# EasyEDA schematic G1000_Cessna_Main.json
TITLE: G1000_Cessna_Main; REV: 1.0; Date: 2024-05-07; Sheet: 1/1; Drawn By: gagagu1; Company: Gagagu
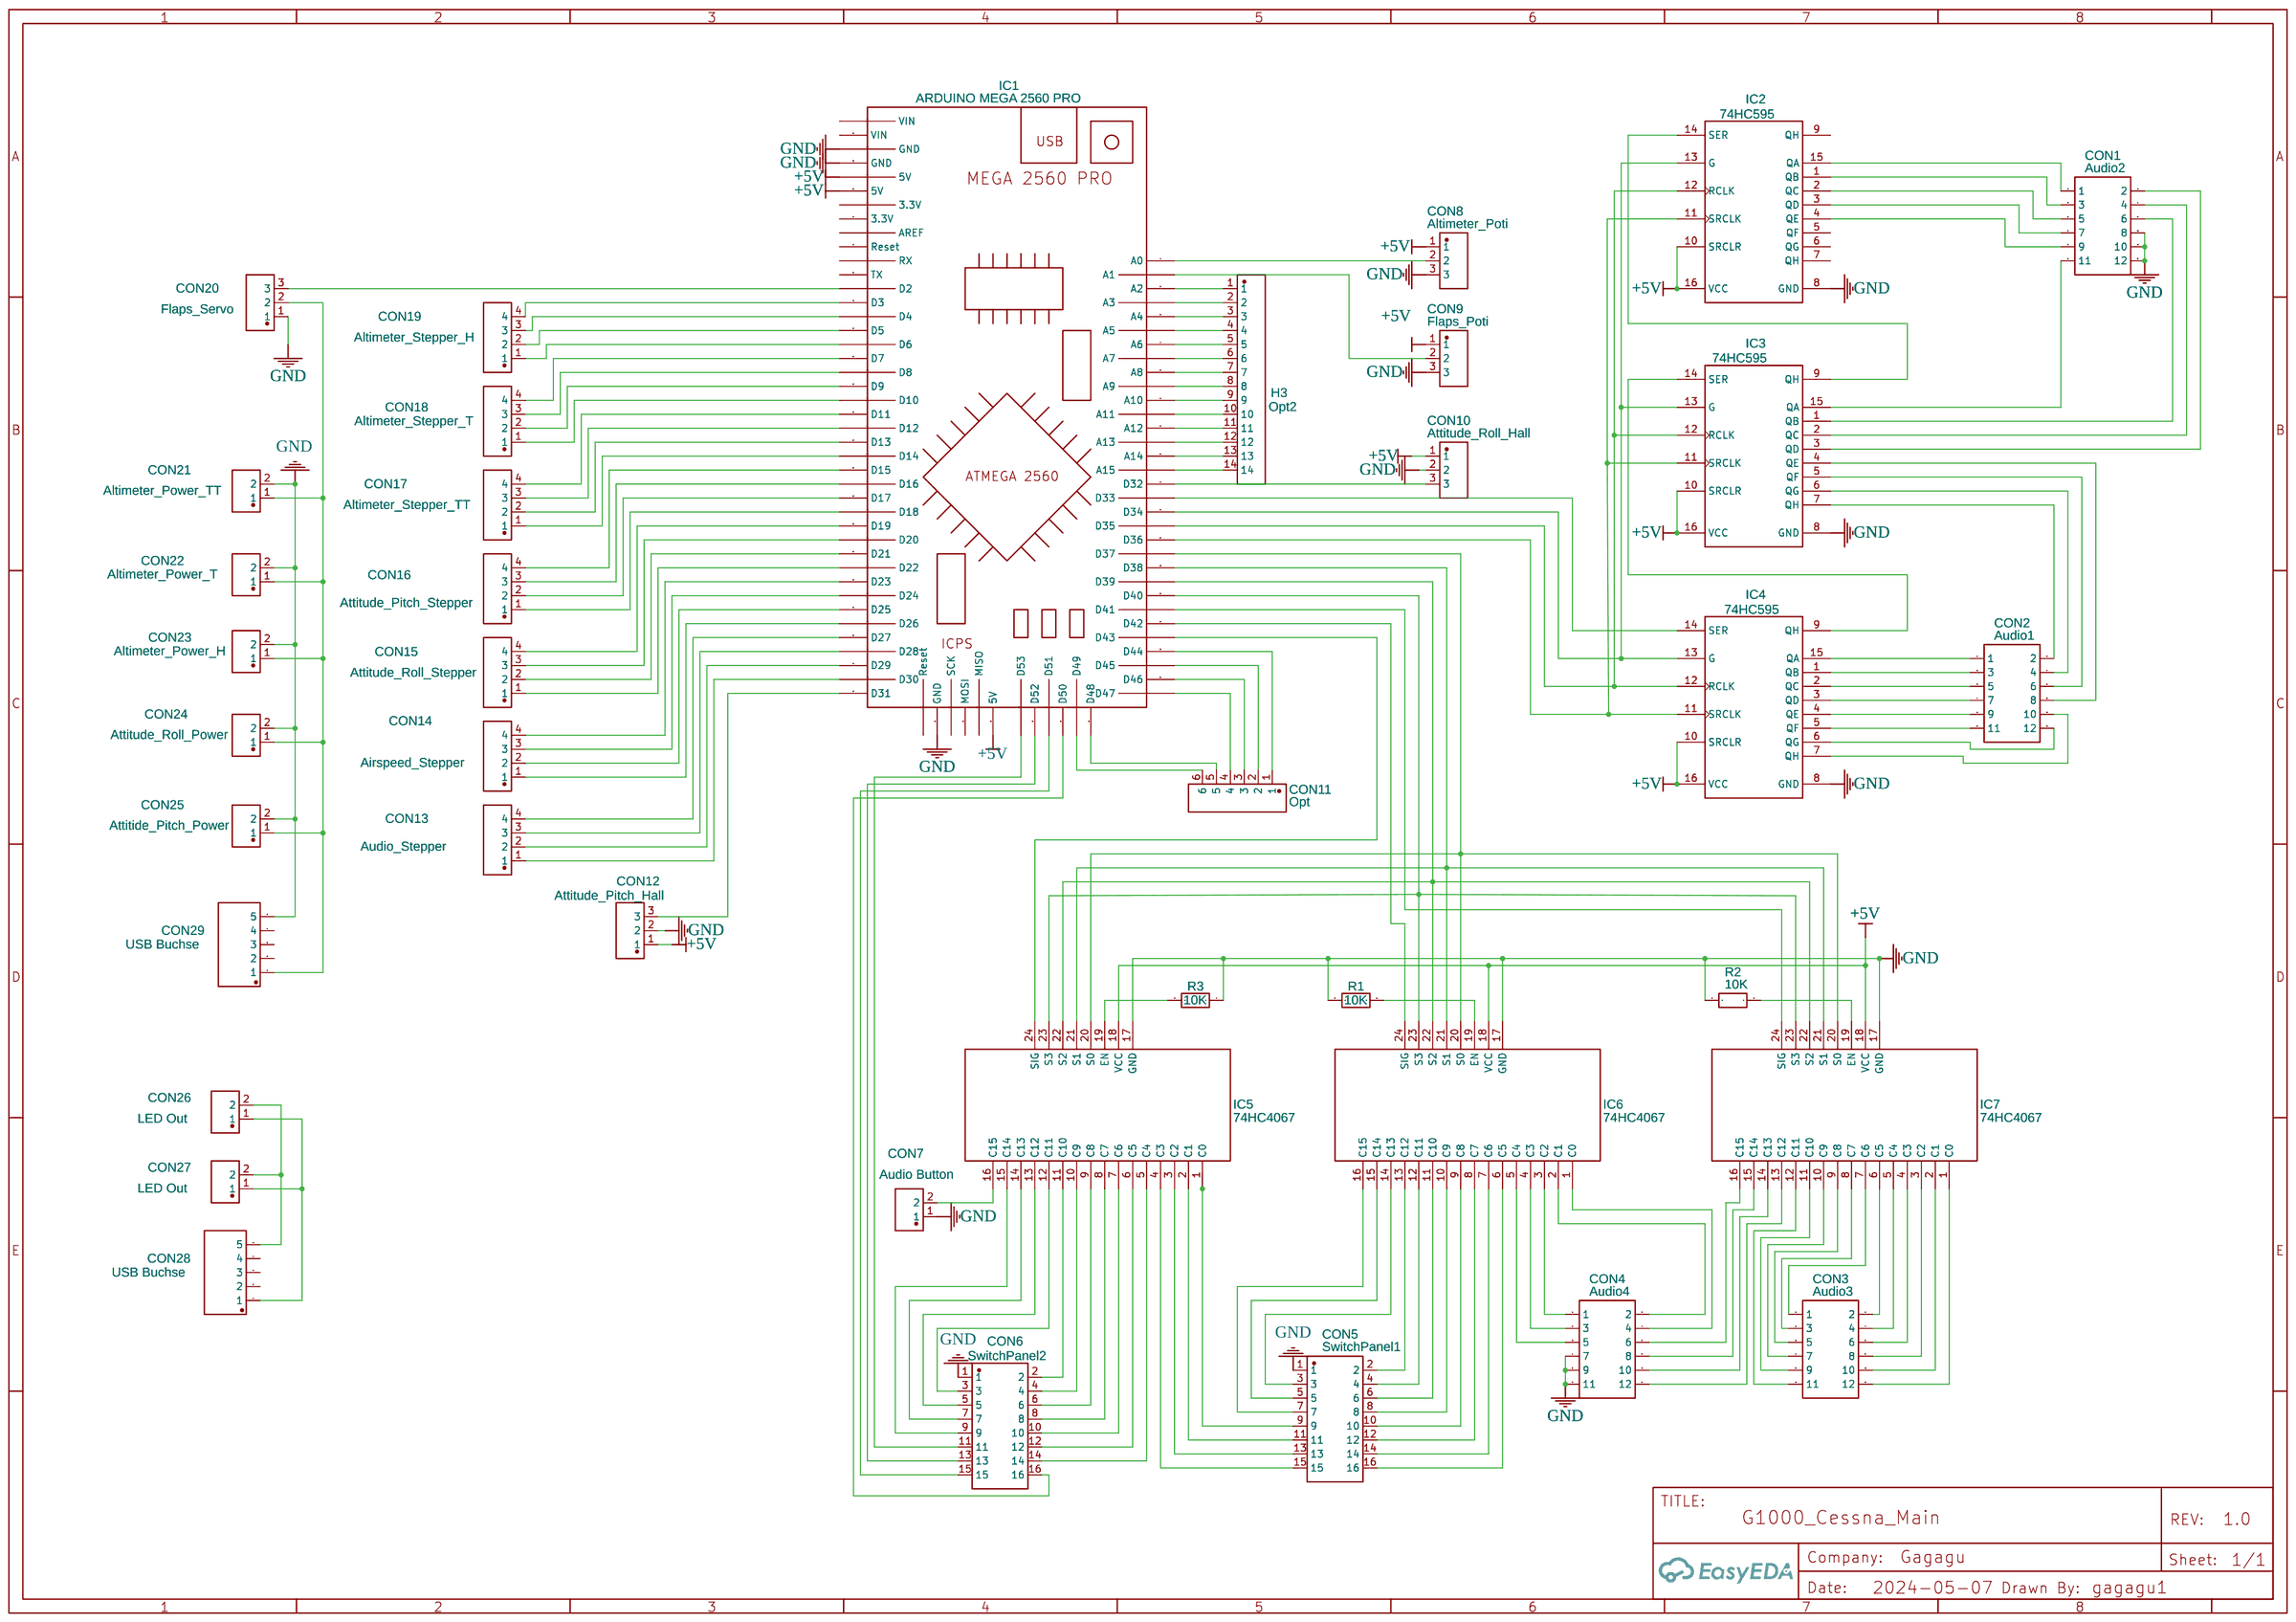
[diagram p0: schematic sheet]

## Parts
CON1  Audio2  [IDC-TH_12P-P2.54_BOOMELE-2X6P-2.54MM]
CON2  Audio1  [IDC-TH_12P-P2.54_BOOMELE-2X6P-2.54MM]
CON3  Audio3  [IDC-TH_12P-P2.54_BOOMELE-2X6P-2.54MM]
CON4  Audio4  [IDC-TH_12P-P2.54_BOOMELE-2X6P-2.54MM]
CON5  SwitchPanel1  [CONN-TH_16P-P2.54_KINGHELM_KH-2.54PH180-2X8P-L8.9]
CON6  SwitchPanel2  [CONN-TH_16P-P2.54_KINGHELM_KH-2.54PH180-2X8P-L8.9]
CON7  Audio Button  [CONN-TH_2P-P2.50_HC-XH-2A-G]
CON8  Altimeter_Poti  [CONN-TH_3P-P2.50_HC-XH-3A-G]
CON9  Flaps_Poti  [CONN-TH_3P-P2.50_HC-XH-3A-G]
CON10  Attitude_Roll_Hall  [CONN-TH_3P-P2.50_HC-XH-3A-G]
CON11  Opt  [ARUN-CONN-TH_XH-6A]
CON12  Attitude_Pitch_Hall  [CONN-TH_3P-P2.50_HC-XH-3A-G]
CON13  Audio_Stepper  [ARUN-CONN-TH_XH-4A-1]
CON14  Airspeed_Stepper  [ARUN-CONN-TH_XH-4A-1]
CON15  Attitude_Roll_Stepper  [ARUN-CONN-TH_XH-4A-1]
CON16  Attitude_Pitch_Stepper  [ARUN-CONN-TH_XH-4A-1]
CON17  Altimeter_Stepper_TT  [ARUN-CONN-TH_XH-4A-1]
CON18  Altimeter_Stepper_T  [ARUN-CONN-TH_XH-4A-1]
CON19  Altimeter_Stepper_H  [ARUN-CONN-TH_XH-4A-1]
CON20  Flaps_Servo  [CONN-TH_3P-P2.50_HC-XH-3A-G]
CON21  Altimeter_Power_TT  [CONN-TH_2P-P2.50_HC-XH-2A-G]
CON22  Altimeter_Power_T  [CONN-TH_2P-P2.50_HC-XH-2A-G]
CON23  Altimeter_Power_H  [CONN-TH_2P-P2.50_HC-XH-2A-G]
CON24  Attitude_Roll_Power  [CONN-TH_2P-P2.50_HC-XH-2A-G]
CON25  Attitide_Pitch_Power  [CONN-TH_2P-P2.50_HC-XH-2A-G]
CON26  LED Out  [CONN-TH_2P-P2.50_HC-XH-2A-G]
CON27  LED Out  [CONN-TH_2P-P2.50_HC-XH-2A-G]
CON28  USB Buchse  [DIP-1X5P-2.54MM-M]
CON29  USB Buchse  [DIP-1X5P-2.54MM-M]
H3  Opt2  [CONN-TH_KINGHELM_KH-2FH-1X14P-H4.3]
IC1  ARDUINO MEGA 2560 PRO  [ARDUINO MEGA 2560 PRO]
IC2  74HC595  [SN74HC595N_DIP]
IC3  74HC595  [SN74HC595N_DIP]
IC4  74HC595  [SN74HC595N_DIP]
IC5  74HC4067  [CD74HC4067]
IC6  74HC4067  [CD74HC4067]
IC7  74HC4067  [CD74HC4067]
R1  10K  [R_AXIAL-0.4]
R2  10K  [R_AXIAL-0.4]
R3  10K  [R_AXIAL-0.4]

## Library data of the parts
CON1-CON4 = SOCKET HDR-IDC-2.54-2X6P: Supplier: LCSC; Manufacturer: BOOMELE(博穆精密); Manufacturer Part: 2.54-2*6P简牛; Supplier Part: C9136; JLCPCB Part Class: Extended Part
CON5 CON6 = KH-2.54PH180-2X8P-L8.9: Contributor: lcsc; Supplier: LCSC; Supplier Part: C5157631; Manufacturer: kinghelm(金航标); JLCPCB Part Class: Extended Part
CON7 CON21-CON27 = HC-XH-2A-G: Supplier: LCSC; Supplier Part: C5341201; Manufacturer: HCTL(华灿天禄); link: https://atta.szlcsc.com/upload/public/pdf/source/20230105/4FFD2EFD3DA44AA828171A44400F3EDE.pdf; Contributor: zafariqbal832159; JLCPCB Part Class: Extended Part
CON8-CON10 CON12 CON20 = HC-XH-3A-G: Contributor: Мэтт Милер; Supplier: LCSC; Supplier Part: C5341202; Manufacturer: HCTL(华灿天禄); JLCPCB Part Class: Extended Part
CON11 = ARUN-CONN-TH_XH-6A: Supplier: LCSC; Supplier Part: C722879; Manufacturer: CAX; Manufacturer Part: XH-6A; Contributor: LCSC; JLCPCB Part Class: Extended Part
CON13-CON19 = ARUN-CONN-TH_XH-4A: Supplier: LCSC; Supplier Part: C192885; Manufacturer: BOOMELE(博穆精密); Manufacturer Part: XH-4A绿色; JLCPCB Part Class: Extended Part; Contributor: LCSC
CON28 CON29 = Battery Pack Connector: Supplier Part: C124379; Supplier: LCSC; Manufacturer: Ckmtw; Manufacturer Part: 210S-1*5P L=11.6MMGold-plated black; Contributor: ee21resch01009
H3 = KH-1.27PH180-1X14P-L7.2: Contributor: LCSC; Supplier: LCSC; Supplier Part: C2938406; Manufacturer: kinghelm(金航标)
IC1 = ARDUINO MEGA 2560 PRO_2020: Manufacturer Part: Arduino Mega 2560 Pro Mini; link: https://www.arduino.cc; Contributor: sinivan003
IC2-IC4 = SN74HC595N_DIP: 8-bit Shift Register  Latch with 3-State Outputs; Contributor: hoangvanthanh1629
IC5-IC7 = CD74HC4067: sourceId: 1T5FDZYC8; Contributor: andy vu
R1-R3 = R_AXIAL-0.4_EU: Contributor: LCEDA_Lib

## Nets
+5V: CON8.1 CON9.1 CON10.1 CON12.1 IC1.39(5V) IC1.81(5V) IC1.82(5V) IC2.10(SRCLR) IC2.16(VCC) IC3.10(SRCLR) IC3.16(VCC) IC4.10(SRCLR) IC4.16(VCC) IC5.18(VCC) IC6.18(VCC) IC7.18(VCC)
GND: CON1.8 CON1.10 CON1.12 CON4.7 CON4.9 CON4.11 CON5.1 CON6.1 CON7.1 CON8.3 CON9.3 CON10.2 CON12.2 CON20.1 CON21.2 CON22.2 CON23.2 CON24.2 CON25.2 CON29.5 IC1.43(GND) IC1.83(GND) IC1.84(GND) IC2.8(GND) IC3.8(GND) IC4.8(GND) IC5.17(GND) IC6.17(GND) IC7.17(GND) R1.2 R2.1 R3.1
Net-(CON1-1): CON1.1 IC2.15(QA)
Net-(CON1-2): CON1.2 IC3.3(QD)
Net-(CON1-3): CON1.3 IC2.1(QB)
Net-(CON1-4): CON1.4 IC3.2(QC)
Net-(CON1-5): CON1.5 IC2.2(QC)
Net-(CON1-6): CON1.6 IC3.1(QB)
Net-(CON1-7): CON1.7 IC2.3(QD)
Net-(CON1-9): CON1.9 IC2.4(QE)
Net-(CON1-11): CON1.11 IC3.15(QA)
Net-(CON2-1): CON2.1 IC4.15(QA)
Net-(CON2-2): CON2.2 IC3.7(QH)
Net-(CON2-3): CON2.3 IC4.1(QB)
Net-(CON2-4): CON2.4 IC3.6(QG)
Net-(CON2-5): CON2.5 IC4.2(QC)
Net-(CON2-6): CON2.6 IC3.5(QF)
Net-(CON2-7): CON2.7 IC4.3(QD)
Net-(CON2-8): CON2.8 IC3.4(QE)
Net-(CON2-9): CON2.9 IC4.4(QE)
Net-(CON2-10): CON2.10 IC4.7(QH)
Net-(CON2-11): CON2.11 IC4.5(QF)
Net-(CON2-12): CON2.12 IC4.6(QG)
Net-(CON3-1): CON3.1 IC7.7(C6)
Net-(CON3-2): CON3.2 IC7.6(C5)
Net-(CON3-3): CON3.3 IC7.8(C7)
Net-(CON3-4): CON3.4 IC7.5(C4)
Net-(CON3-5): CON3.5 IC7.9(C8)
Net-(CON3-6): CON3.6 IC7.4(C3)
Net-(CON3-7): CON3.7 IC7.10(C9)
Net-(CON3-8): CON3.8 IC7.3(C2)
Net-(CON3-9): CON3.9 IC7.11(C10)
Net-(CON3-10): CON3.10 IC7.2(C1)
Net-(CON3-11): CON3.11 IC7.12(C11)
Net-(CON3-12): CON3.12 IC7.1(C0)
Net-(CON4-1): CON4.1 IC6.3(C2)
Net-(CON4-2): CON4.2 IC6.2(C1)
Net-(CON4-3): CON4.3 IC6.4(C3)
Net-(CON4-4): CON4.4 IC6.1(C0)
Net-(CON4-5): CON4.5 IC6.5(C4)
Net-(CON4-6): CON4.6 IC7.16(C15)
Net-(CON4-8): CON4.8 IC7.15(C14)
Net-(CON4-10): CON4.10 IC7.14(C13)
Net-(CON4-12): CON4.12 IC7.13(C12)
Net-(CON5-2): CON5.2 IC6.13(C12)
Net-(CON5-3): CON5.3 IC6.14(C13)
Net-(CON5-4): CON5.4 IC6.12(C11)
Net-(CON5-5): CON5.5 IC6.15(C14)
Net-(CON5-6): CON5.6 IC6.11(C10)
Net-(CON5-7): CON5.7 IC6.16(C15)
Net-(CON5-8): CON5.8 IC6.10(C9)
Net-(CON5-9): CON5.9 IC5.1(C0)
Net-(CON5-10): CON5.10 IC6.9(C8)
Net-(CON5-11): CON5.11 IC5.2(C1)
Net-(CON5-12): CON5.12 IC6.8(C7)
Net-(CON5-13): CON5.13 IC5.3(C2)
Net-(CON5-14): CON5.14 IC6.7(C6)
Net-(CON5-15): CON5.15 IC5.4(C3)
Net-(CON5-16): CON5.16 IC6.6(C5)
Net-(CON6-2): CON6.2 IC5.11(C10)
Net-(CON6-3): CON6.3 IC5.12(C11)
Net-(CON6-4): CON6.4 IC5.10(C9)
Net-(CON6-5): CON6.5 IC5.13(C12)
Net-(CON6-6): CON6.6 IC5.9(C8)
Net-(CON6-7): CON6.7 IC5.14(C13)
Net-(CON6-8): CON6.8 IC5.8(C7)
Net-(CON6-9): CON6.9 IC5.15(C14)
Net-(CON6-10): CON6.10 IC5.7(C6)
Net-(CON6-11): CON6.11 IC1.38(D53)
Net-(CON6-12): CON6.12 IC5.6(C5)
Net-(CON6-13): CON6.13 IC1.37(D52)
Net-(CON6-14): CON6.14 IC5.5(C4)
Net-(CON6-15): CON6.15 IC1.36(D51)
Net-(CON6-16): CON6.16 IC1.35(D50)
Net-(CON7-2): CON7.2 IC5.16(C15)
Net-(CON8-2): CON8.2 IC1.1(A0)
Net-(CON9-2): CON9.2 IC1.2(A1)
Net-(CON10-3): CON10.3 IC1.17(D32)
Net-(CON11-1): CON11.1 IC1.29(D44)
Net-(CON11-2): CON11.2 IC1.30(D45)
Net-(CON11-3): CON11.3 IC1.31(D46)
Net-(CON11-4): CON11.4 IC1.32(D47)
Net-(CON11-5): CON11.5 IC1.33(D48)
Net-(CON11-6): CON11.6 IC1.34(D49)
Net-(CON12-3): CON12.3 IC1.45(D31)
Net-(CON13-1): CON13.1 IC1.46(D30)
Net-(CON13-2): CON13.2 IC1.47(D29)
Net-(CON13-3): CON13.3 IC1.48(D28)
Net-(CON13-4): CON13.4 IC1.49(D27)
Net-(CON14-1): CON14.1 IC1.50(D26)
Net-(CON14-2): CON14.2 IC1.51(D25)
Net-(CON14-3): CON14.3 IC1.52(D24)
Net-(CON14-4): CON14.4 IC1.53(D23)
Net-(CON15-1): CON15.1 IC1.54(D22)
Net-(CON15-2): CON15.2 IC1.55(D21)
Net-(CON15-3): CON15.3 IC1.56(D20)
Net-(CON15-4): CON15.4 IC1.57(D19)
Net-(CON16-1): CON16.1 IC1.58(D18)
Net-(CON16-2): CON16.2 IC1.59(D17)
Net-(CON16-3): CON16.3 IC1.60(D16)
Net-(CON16-4): CON16.4 IC1.61(D15)
Net-(CON17-1): CON17.1 IC1.62(D14)
Net-(CON17-2): CON17.2 IC1.63(D13)
Net-(CON17-3): CON17.3 IC1.64(D12)
Net-(CON17-4): CON17.4 IC1.65(D11)
Net-(CON18-1): CON18.1 IC1.66(D10)
Net-(CON18-2): CON18.2 IC1.67(D9)
Net-(CON18-3): CON18.3 IC1.68(D8)
Net-(CON18-4): CON18.4 IC1.69(D7)
Net-(CON19-1): CON19.1 IC1.70(D6)
Net-(CON19-2): CON19.2 IC1.71(D5)
Net-(CON19-3): CON19.3 IC1.72(D4)
Net-(CON19-4): CON19.4 IC1.73(D3)
Net-(CON20-2): CON20.2 CON21.1 CON22.1 CON23.1 CON24.1 CON25.1 CON29.1
Net-(CON20-3): CON20.3 IC1.74(D2)
Net-(CON26-1): CON26.1 CON27.1 CON28.1
Net-(CON26-2): CON26.2 CON27.2 CON28.5
Net-(H3-1): H3.1 IC1.3(A2)
Net-(H3-2): H3.2 IC1.4(A3)
Net-(H3-3): H3.3 IC1.5(A4)
Net-(H3-4): H3.4 IC1.6(A5)
Net-(H3-5): H3.5 IC1.7(A6)
Net-(H3-6): H3.6 IC1.8(A7)
Net-(H3-7): H3.7 IC1.9(A8)
Net-(H3-8): H3.8 IC1.10(A9)
Net-(H3-9): H3.9 IC1.11(A10)
Net-(H3-10): H3.10 IC1.12(A11)
Net-(H3-11): H3.11 IC1.13(A12)
Net-(H3-12): H3.12 IC1.14(A13)
Net-(H3-13): H3.13 IC1.15(A14)
Net-(H3-14): H3.14 IC1.16(A15)
Net-(IC1-18): IC1.18(D33) IC4.14(SER)
Net-(IC1-19): IC1.19(D34) IC2.13(G) IC3.13(G) IC4.13(G)
Net-(IC1-20): IC1.20(D35) IC2.12(RCLK) IC3.12(RCLK) IC4.12(RCLK)
Net-(IC1-21): IC1.21(D36) IC2.11(SRCLK) IC3.11(SRCLK) IC4.11(SRCLK)
Net-(IC1-22): IC1.22(D37) IC5.20(S0) IC6.20(S0) IC7.20(S0)
Net-(IC1-23): IC1.23(D38) IC5.21(S1) IC6.21(S1) IC7.21(S1)
Net-(IC1-24): IC1.24(D39) IC5.22(S2) IC6.22(S2) IC7.22(S2)
Net-(IC1-25): IC1.25(D40) IC5.23(S3) IC6.23(S3) IC7.23(S3)
Net-(IC1-26): IC1.26(D41) IC7.24(SIG)
Net-(IC1-27): IC1.27(D42) IC6.24(SIG)
Net-(IC1-28): IC1.28(D43) IC5.24(SIG)
Net-(IC2-14): IC2.14(SER) IC3.9(QH)
Net-(IC3-14): IC3.14(SER) IC4.9(QH)
Net-(IC5-19): IC5.19(EN) R3.2
Net-(IC6-19): IC6.19(EN) R1.1
Net-(IC7-19): IC7.19(EN) R2.2

Not connected (* = marked no-connect by the designer): CON28 2 3 4; CON29 2 3 4; IC1 40(MISO) 41(MOSI) 42(SCK) 44(Reset) 75(TX) 76(RX) 77(Reset) 78(AREF) 79(3.3V) 80(3.3V) 85(VIN) 86(VIN); IC2 5(QF) 6(QG) 7(QH) 9(QH)
